# EAGLE schematic MP3_8xMulti_V1.0 (EAGLE 9.6.2)
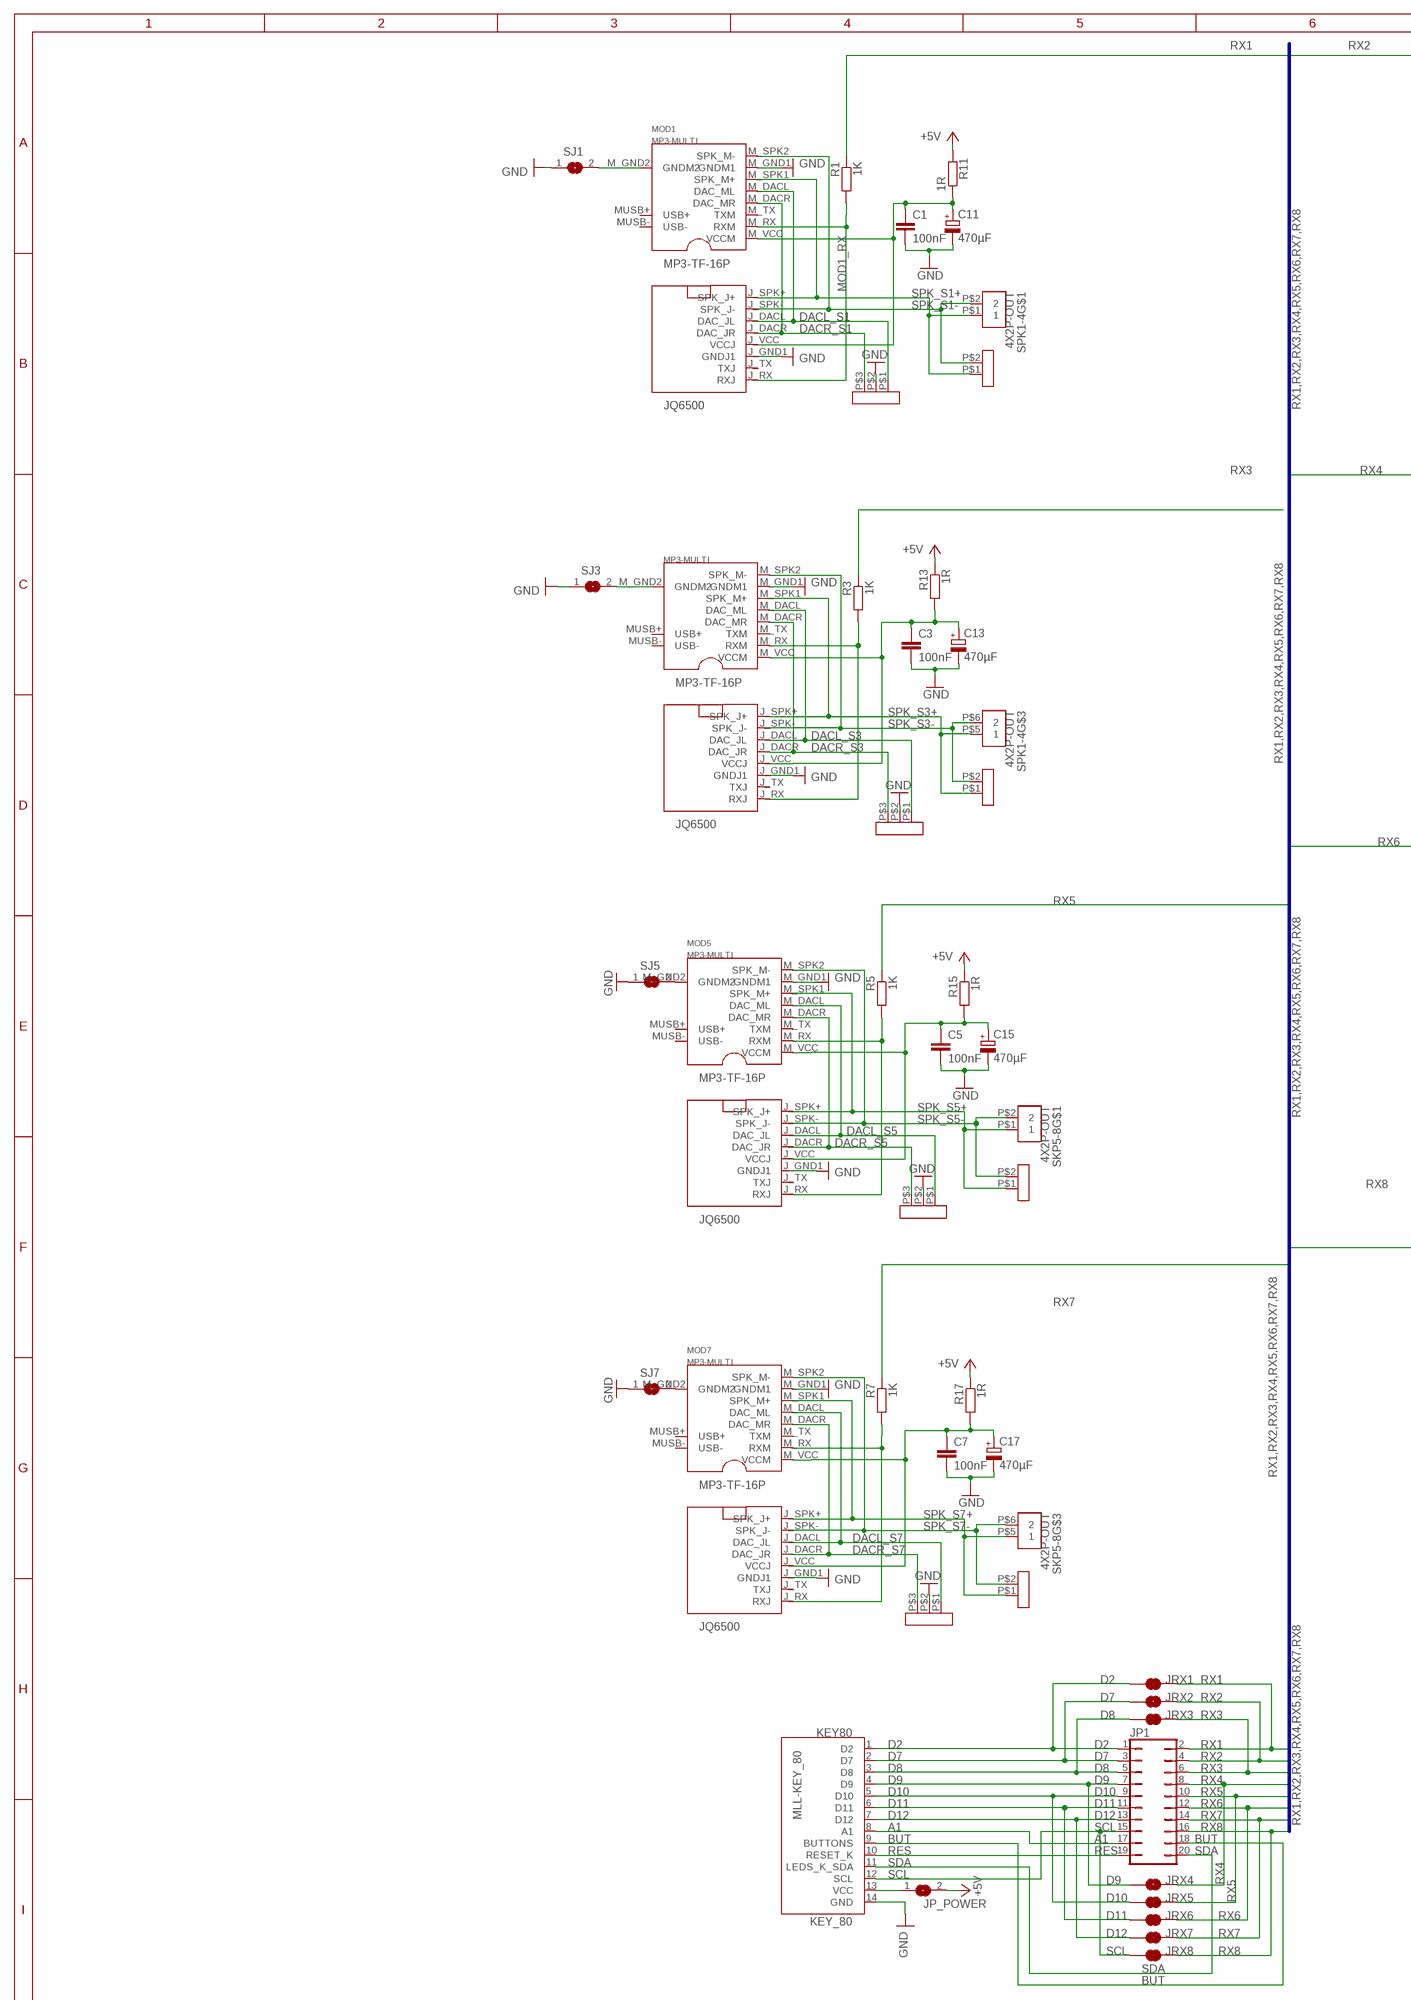
[diagram p0: schematic, sheet 1, part 1 of 2]
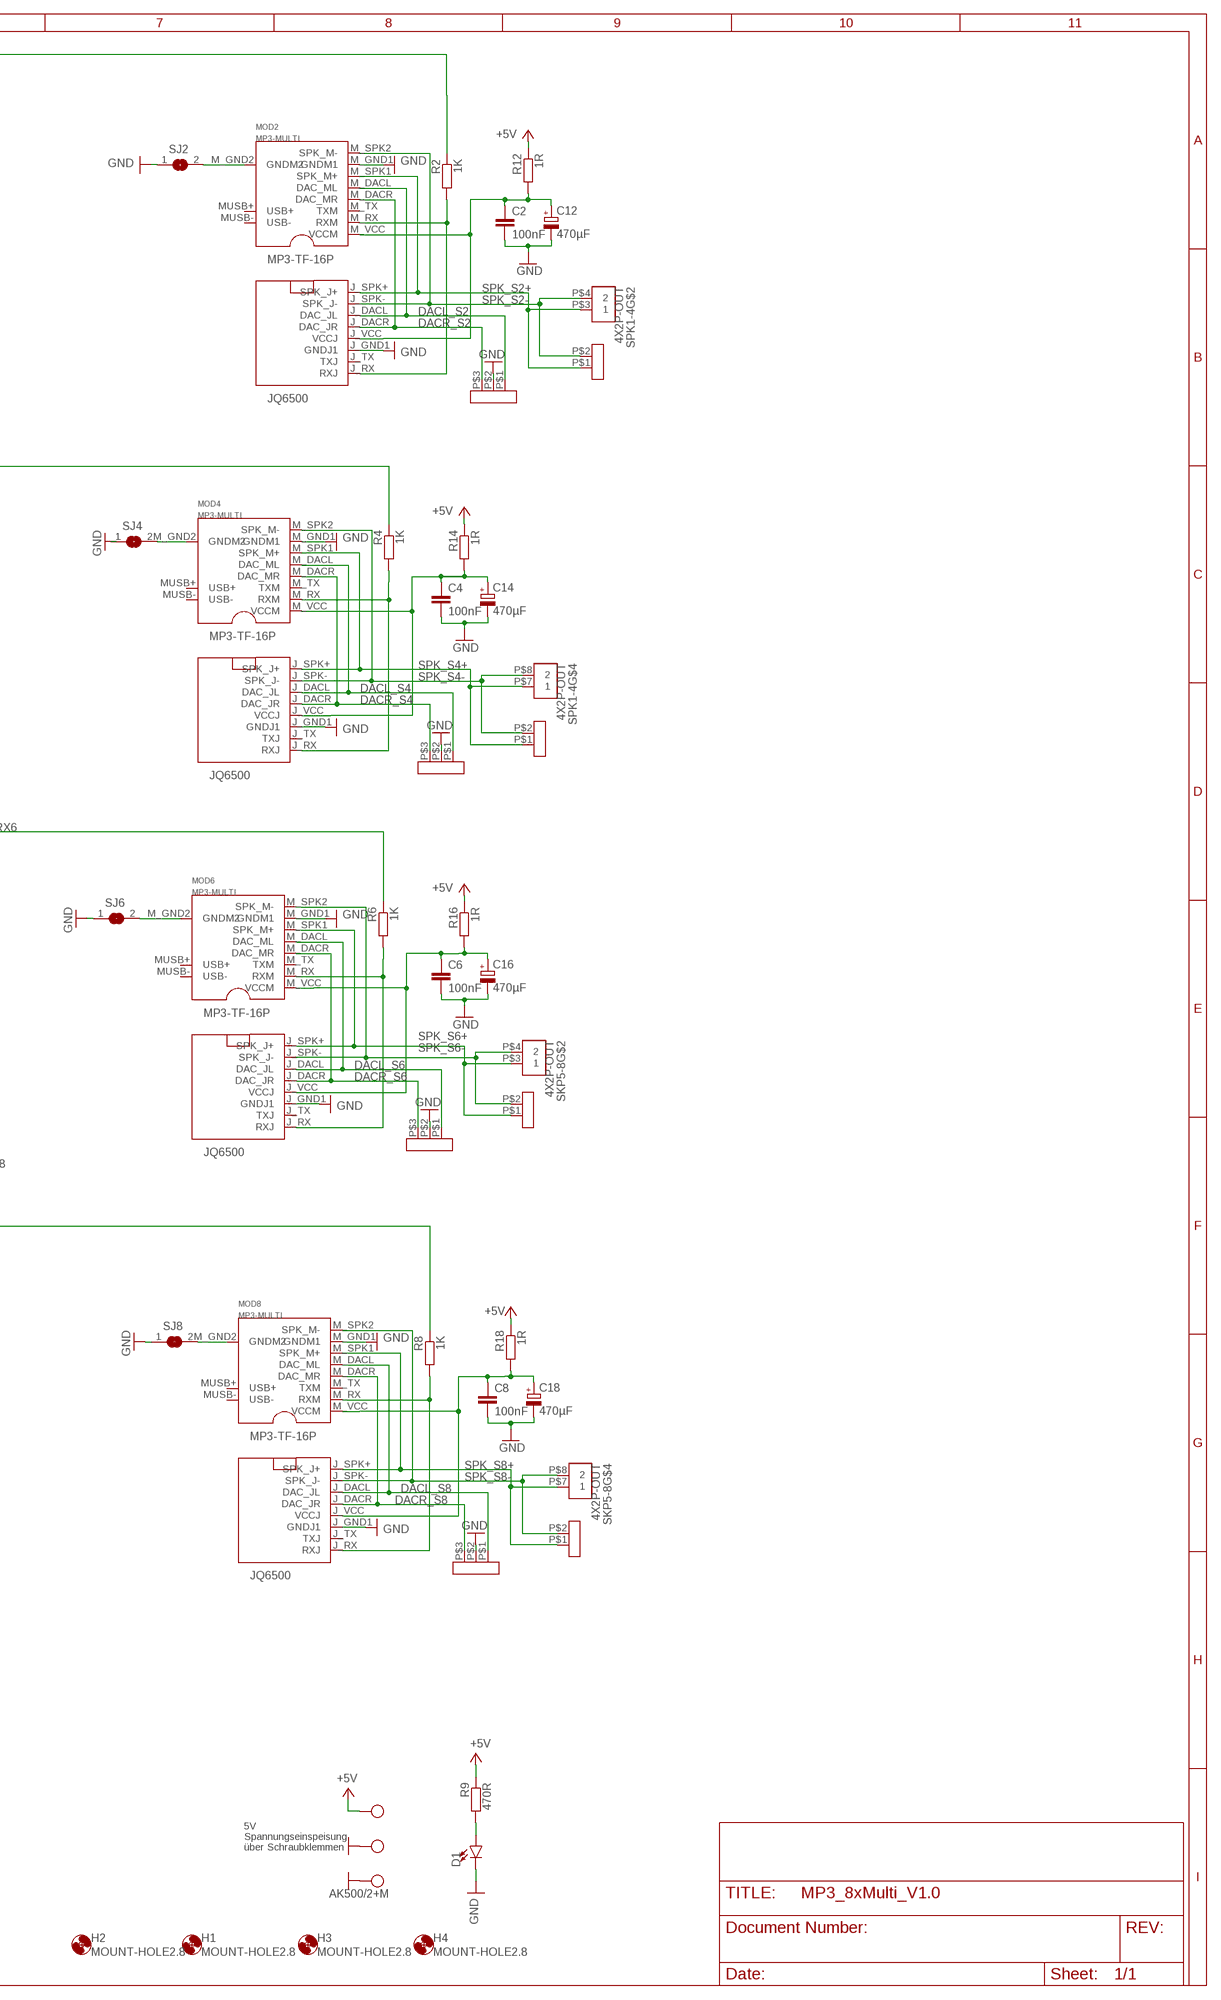
[diagram p1: schematic, sheet 1, part 2 of 2]

## Parts
C1  100nF  C-EU025-025X050  [C025-025X050]
C2  100nF  C-EU025-025X050  [C025-025X050]
C3  100nF  C-EU025-025X050  [C025-025X050]
C4  100nF  C-EU025-025X050  [C025-025X050]
C5  100nF  C-EU025-025X050  [C025-025X050]
C6  100nF  C-EU025-025X050  [C025-025X050]
C7  100nF  C-EU025-025X050  [C025-025X050]
C8  100nF  C-EU025-025X050  [C025-025X050]
C11  470µF  CPOL-EUE5-8.5  [E5-8,5]
C12  470µF  CPOL-EUE5-8.5  [E5-8,5]
C13  470µF  CPOL-EUE5-8.5  [E5-8,5]
C14  470µF  CPOL-EUE5-8.5  [E5-8,5]
C15  470µF  CPOL-EUE5-8.5  [E5-8,5]
C16  470µF  CPOL-EUE5-8.5  [E5-8,5]
C17  470µF  CPOL-EUE5-8.5  [E5-8,5]
C18  470µF  CPOL-EUE5-8.5  [E5-8,5]
D1  LED3MM  [LED_3MM]
DAC1  3XRM254  [3XRM254]
DAC2  3XRM254  [3XRM254]
DAC3  3XRM254  [3XRM254]
DAC4  3XRM254  [3XRM254]
DAC5  3XRM254  [3XRM254]
DAC6  3XRM254  [3XRM254]
DAC7  3XRM254  [3XRM254]
DAC8  3XRM254  [3XRM254]
H1  MOUNT-HOLE2.8  [2,8]
H2  MOUNT-HOLE2.8  [2,8]
H3  MOUNT-HOLE2.8  [2,8]
H4  MOUNT-HOLE2.8  [2,8]
JP1  JP10Q  [JP10Q]
JP_POWER  SJ  [SJ]
JRX1  JUMPER-SMT_2_NC_TRACE_NO-SILK  [SMT-JUMPER_2_NC_TRACE_NO-SILK]
JRX2  JUMPER-SMT_2_NC_TRACE_NO-SILK  [SMT-JUMPER_2_NC_TRACE_NO-SILK]
JRX3  JUMPER-SMT_2_NC_TRACE_NO-SILK  [SMT-JUMPER_2_NC_TRACE_NO-SILK]
JRX4  JUMPER-SMT_2_NC_TRACE_NO-SILK  [SMT-JUMPER_2_NC_TRACE_NO-SILK]
JRX5  JUMPER-SMT_2_NC_TRACE_NO-SILK  [SMT-JUMPER_2_NC_TRACE_NO-SILK]
JRX6  JUMPER-SMT_2_NC_TRACE_NO-SILK  [SMT-JUMPER_2_NC_TRACE_NO-SILK]
JRX7  JUMPER-SMT_2_NC_TRACE_NO-SILK  [SMT-JUMPER_2_NC_TRACE_NO-SILK]
JRX8  JUMPER-SMT_2_NC_TRACE_NO-SILK  [SMT-JUMPER_2_NC_TRACE_NO-SILK]
KEY80  KEY_80  [IDC14]
MOD1  MP3-MULTI  [MP3-TF16P_JQ6500]
MOD2  MP3-MULTI  [MP3-TF16P_JQ6500]
MOD3  MP3-MULTI  [MP3-TF16P_JQ6500]
MOD4  MP3-MULTI  [MP3-TF16P_JQ6500]
MOD5  MP3-MULTI  [MP3-TF16P_JQ6500]
MOD6  MP3-MULTI  [MP3-TF16P_JQ6500]
MOD7  MP3-MULTI  [MP3-TF16P_JQ6500]
MOD8  MP3-MULTI  [MP3-TF16P_JQ6500]
R1  1K  R-EU_0207/7  [0207/7]
R2  1K  R-EU_0207/7  [0207/7]
R3  1K  R-EU_0207/7  [0207/7]
R4  1K  R-EU_0207/7  [0207/7]
R5  1K  R-EU_0207/7  [0207/7]
R6  1K  R-EU_0207/7  [0207/7]
R7  1K  R-EU_0207/7  [0207/7]
R8  1K  R-EU_0207/7  [0207/7]
R9  470R  R-EU_0207/7  [0207/7]
R11  1R  R-EU_0207/7  [0207/7]
R12  1R  R-EU_0207/7  [0207/7]
R13  1R  R-EU_0207/7  [0207/7]
R14  1R  R-EU_0207/7  [0207/7]
R15  1R  R-EU_0207/7  [0207/7]
R16  1R  R-EU_0207/7  [0207/7]
R17  1R  R-EU_0207/7  [0207/7]
R18  1R  R-EU_0207/7  [0207/7]
SJ1  SJ  [SJ]
SJ2  SJ  [SJ]
SJ3  SJ  [SJ]
SJ4  SJ  [SJ]
SJ5  SJ  [SJ]
SJ6  SJ  [SJ]
SJ7  SJ  [SJ]
SJ8  SJ  [SJ]
SKP5-8  4X2P-OUT  [DG308]
SPK1  2XRM254  [2XRM254]
SPK1-4  4X2P-OUT  [DG308]
SPK2  2XRM254  [2XRM254]
SPK3  2XRM254  [2XRM254]
SPK4  2XRM254  [2XRM254]
SPK5  2XRM254  [2XRM254]
SPK6  2XRM254  [2XRM254]
SPK7  2XRM254  [2XRM254]
SPK8  2XRM254  [2XRM254]
X1  AK500/2+M  [AK500/2+M]

## Nets
+5V: JP_POWER.2 R9.1 R11.2 R12.1 R13.1 R14.1 R15.1 R16.1 R17.1 R18.1 X1.2
A1: JP1.17 KEY80.8(A1)
BUT: JP1.18 KEY80.9(BUTTONS)
D2: JP1.1 JRX1.1 KEY80.1(D2)
D7: JP1.3 JRX2.1 KEY80.2(D7)
D8: JP1.5 JRX3.1 KEY80.3(D8)
D9: JP1.7 JRX4.1 KEY80.4(D9)
D10: JP1.9 JRX5.1 KEY80.5(D10)
D11: JP1.11 JRX6.1 KEY80.6(D11)
D12: JP1.13 JRX7.1 KEY80.7(D12)
DACL_S1: DAC1.P$1 MOD1.J_DACL(DAC_JL) MOD1.M_DACL(DAC_ML)
DACL_S2: DAC2.P$1 MOD2.J_DACL(DAC_JL) MOD2.M_DACL(DAC_ML)
DACL_S3: DAC3.P$1 MOD3.J_DACL(DAC_JL) MOD3.M_DACL(DAC_ML)
DACL_S4: DAC4.P$1 MOD4.J_DACL(DAC_JL) MOD4.M_DACL(DAC_ML)
DACL_S5: DAC5.P$1 MOD5.J_DACL(DAC_JL) MOD5.M_DACL(DAC_ML)
DACL_S6: DAC6.P$1 MOD6.J_DACL(DAC_JL) MOD6.M_DACL(DAC_ML)
DACL_S7: DAC7.P$1 MOD7.J_DACL(DAC_JL) MOD7.M_DACL(DAC_ML)
DACL_S8: DAC8.P$1 MOD8.J_DACL(DAC_JL) MOD8.M_DACL(DAC_ML)
DACR_S1: DAC1.P$3 MOD1.J_DACR(DAC_JR) MOD1.M_DACR(DAC_MR)
DACR_S2: DAC2.P$3 MOD2.J_DACR(DAC_JR) MOD2.M_DACR(DAC_MR)
DACR_S3: DAC3.P$3 MOD3.J_DACR(DAC_JR) MOD3.M_DACR(DAC_MR)
DACR_S4: DAC4.P$3 MOD4.J_DACR(DAC_JR) MOD4.M_DACR(DAC_MR)
DACR_S5: DAC5.P$3 MOD5.J_DACR(DAC_JR) MOD5.M_DACR(DAC_MR)
DACR_S6: DAC6.P$3 MOD6.J_DACR(DAC_JR) MOD6.M_DACR(DAC_MR)
DACR_S7: DAC7.P$3 MOD7.J_DACR(DAC_JR) MOD7.M_DACR(DAC_MR)
DACR_S8: DAC8.P$3 MOD8.J_DACR(DAC_JR) MOD8.M_DACR(DAC_MR)
GND: C1.2 C2.2 C3.2 C4.2 C5.2 C6.2 C7.2 C8.2 C11.- C12.- C13.- C14.- C15.- C16.- C17.- C18.- D1.K(C) DAC1.P$2 DAC2.P$2 DAC3.P$2 DAC4.P$2 DAC5.P$2 DAC6.P$2 DAC7.P$2 DAC8.P$2 KEY80.14(GND) MOD1.J_GND1(GNDJ1) MOD1.M_GND1(GNDM1) MOD2.J_GND1(GNDJ1) MOD2.M_GND1(GNDM1) MOD3.J_GND1(GNDJ1) MOD3.M_GND1(GNDM1) MOD4.J_GND1(GNDJ1) MOD4.M_GND1(GNDM1) MOD5.J_GND1(GNDJ1) MOD5.M_GND1(GNDM1) MOD6.J_GND1(GNDJ1) MOD6.M_GND1(GNDM1) MOD7.J_GND1(GNDJ1) MOD7.M_GND1(GNDM1) MOD8.J_GND1(GNDJ1) MOD8.M_GND1(GNDM1) SJ1.1 SJ2.1 SJ3.1 SJ4.1 SJ5.1 SJ6.1 SJ7.1 SJ8.1 X1.1 X1.M
LED1: D1.A R9.2
M_GND1: MOD1.M_GND2(GNDM2) SJ1.2
M_GND2: MOD2.M_GND2(GNDM2) SJ2.2
M_GND3: MOD3.M_GND2(GNDM2) SJ3.2
M_GND4: MOD4.M_GND2(GNDM2) SJ4.2
M_GND5: MOD5.M_GND2(GNDM2) SJ5.2
M_GND6: MOD6.M_GND2(GNDM2) SJ6.2
M_GND7: MOD7.M_GND2(GNDM2) SJ7.2
M_GND8: MOD8.M_GND2(GNDM2) SJ8.2
MOD1_RX: MOD1.J_RX(RXJ) MOD1.M_RX(RXM) R1.2
MOD1_RX1: MOD2.J_RX(RXJ) MOD2.M_RX(RXM) R2.2
MOD1_RX2: MOD3.J_RX(RXJ) MOD3.M_RX(RXM) R3.2
MOD1_RX3: MOD4.J_RX(RXJ) MOD4.M_RX(RXM) R4.2
MOD1_RX4: MOD5.J_RX(RXJ) MOD5.M_RX(RXM) R5.2
MOD1_RX5: MOD6.J_RX(RXJ) MOD6.M_RX(RXM) R6.2
MOD1_RX6: MOD7.J_RX(RXJ) MOD7.M_RX(RXM) R7.2
MOD1_RX7: MOD8.J_RX(RXJ) MOD8.M_RX(RXM) R8.2
OPT-VCC: JP_POWER.1 KEY80.13(VCC)
RES: JP1.19 KEY80.10(RESET_K)
RX1: JP1.2 JRX1.2 R1.1
RX2: JP1.4 JRX2.2 R2.1
RX3: JP1.6 JRX3.2 R3.1
RX4: JP1.8 JRX4.2 R4.1
RX5: JP1.10 JRX5.2 R5.1
RX6: JP1.12 JRX6.2 R6.1
RX7: JP1.14 JRX7.2 R7.1
RX8: JP1.16 JRX8.2 R8.1
SCL: JP1.15 JRX8.1 KEY80.12(SCL)
SDA: JP1.20 KEY80.11(LEDS_K_SDA)
SOUND1_VCC: C1.1 C11.+ MOD1.J_VCC(VCCJ) MOD1.M_VCC(VCCM) R11.1
SOUND2_VCC: C2.1 C12.+ MOD2.J_VCC(VCCJ) MOD2.M_VCC(VCCM) R12.2
SOUND3_VCC: C3.1 C13.+ MOD3.J_VCC(VCCJ) MOD3.M_VCC(VCCM) R13.2
SOUND4_VCC: C4.1 C14.+ MOD4.J_VCC(VCCJ) MOD4.M_VCC(VCCM) R14.2
SOUND5_VCC: C5.1 C15.+ MOD5.J_VCC(VCCJ) MOD5.M_VCC(VCCM) R15.2
SOUND6_VCC: C6.1 C16.+ MOD6.J_VCC(VCCJ) MOD6.M_VCC(VCCM) R16.2
SOUND7_VCC: C7.1 C17.+ MOD7.J_VCC(VCCJ) MOD7.M_VCC(VCCM) R17.2
SOUND8_VCC: C8.1 C18.+ MOD8.J_VCC(VCCJ) MOD8.M_VCC(VCCM) R18.2
SPK_S1+: MOD1.J_SPK+(SPK_J+) MOD1.M_SPK1(SPK_M+) SPK1-4.P$1 SPK1.P$1
SPK_S1-: MOD1.J_SPK-(SPK_J-) MOD1.M_SPK2(SPK_M-) SPK1-4.P$2 SPK1.P$2
SPK_S2+: MOD2.J_SPK+(SPK_J+) MOD2.M_SPK1(SPK_M+) SPK1-4.P$3 SPK2.P$1
SPK_S2-: MOD2.J_SPK-(SPK_J-) MOD2.M_SPK2(SPK_M-) SPK1-4.P$4 SPK2.P$2
SPK_S3+: MOD3.J_SPK+(SPK_J+) MOD3.M_SPK1(SPK_M+) SPK1-4.P$5 SPK3.P$1
SPK_S3-: MOD3.J_SPK-(SPK_J-) MOD3.M_SPK2(SPK_M-) SPK1-4.P$6 SPK3.P$2
SPK_S4+: MOD4.J_SPK+(SPK_J+) MOD4.M_SPK1(SPK_M+) SPK1-4.P$7 SPK4.P$1
SPK_S4-: MOD4.J_SPK-(SPK_J-) MOD4.M_SPK2(SPK_M-) SPK1-4.P$8 SPK4.P$2
SPK_S5+: MOD5.J_SPK+(SPK_J+) MOD5.M_SPK1(SPK_M+) SKP5-8.P$1 SPK5.P$1
SPK_S5-: MOD5.J_SPK-(SPK_J-) MOD5.M_SPK2(SPK_M-) SKP5-8.P$2 SPK5.P$2
SPK_S6+: MOD6.J_SPK+(SPK_J+) MOD6.M_SPK1(SPK_M+) SKP5-8.P$3 SPK6.P$1
SPK_S6-: MOD6.J_SPK-(SPK_J-) MOD6.M_SPK2(SPK_M-) SKP5-8.P$4 SPK6.P$2
SPK_S7+: MOD7.J_SPK+(SPK_J+) MOD7.M_SPK1(SPK_M+) SKP5-8.P$5 SPK7.P$1
SPK_S7-: MOD7.J_SPK-(SPK_J-) MOD7.M_SPK2(SPK_M-) SKP5-8.P$6 SPK7.P$2
SPK_S8+: MOD8.J_SPK+(SPK_J+) MOD8.M_SPK1(SPK_M+) SKP5-8.P$7 SPK8.P$1
SPK_S8-: MOD8.J_SPK-(SPK_J-) MOD8.M_SPK2(SPK_M-) SKP5-8.P$8 SPK8.P$2
Unconnected: MOD1.J_TX(TXJ) MOD1.M_TX(TXM) MOD1.MUSB+(USB+) MOD1.MUSB-(USB-) MOD2.J_TX(TXJ) MOD2.M_TX(TXM) MOD2.MUSB+(USB+) MOD2.MUSB-(USB-) MOD3.J_TX(TXJ) MOD3.M_TX(TXM) MOD3.MUSB+(USB+) MOD3.MUSB-(USB-) MOD4.J_TX(TXJ) MOD4.M_TX(TXM) MOD4.MUSB+(USB+) MOD4.MUSB-(USB-) MOD5.J_TX(TXJ) MOD5.M_TX(TXM) MOD5.MUSB+(USB+) MOD5.MUSB-(USB-) MOD6.J_TX(TXJ) MOD6.M_TX(TXM) MOD6.MUSB+(USB+) MOD6.MUSB-(USB-) MOD7.J_TX(TXJ) MOD7.M_TX(TXM) MOD7.MUSB+(USB+) MOD7.MUSB-(USB-) MOD8.J_TX(TXJ) MOD8.M_TX(TXM) MOD8.MUSB+(USB+) MOD8.MUSB-(USB-)

## Buses
RX1,RX2,RX3,RX4,RX5,RX6,RX7,RX8

## Notes on the sheet
- 5V
  Spannungseinspeisung
  über Schraubklemmen

## Library data of the parts
C1-C8 = rcl:C-EU: CAPACITOR, European symbol; SPICEPREFIX: C
C11-C18 = rcl:CPOL-EU: POLARIZED CAPACITOR, European symbol; SPICEPREFIX: C
D1 = SparkFun-LED:LED: LED (Generic) Standard schematic elements and footprints for 5mm, 3mm, 1206, and 0603 sized LEDs. Generic LEDs with no color specified.; PROD_ID: DIO-08794
DAC1-DAC8 = MLL-Dominik-Hardi:3XRM254
H1-H4 = holes:MOUNT-HOLE: MOUNTING HOLE with drill center marker
JP1 = jumper:JP10Q: JUMPER
JP_POWER SJ1-SJ8 = jumper:SJ: SMD solder JUMPER
JRX1-JRX8 = SparkFun-Jumpers:JUMPER-SMT_2_NC_TRACE: Normally closed trace jumper This jumper has a trace between two pads so it's normally closed (NC). Use a razor knife to open the connection. For best results follow the IPC guidelines for cutting traces: Cutout at least 0.063 mm (0.005 in). Remove all loose material to clean up the cut area. Seal the cut with an approved epoxy. Reapply solder to reclose the connection.
KEY80 = MLL-Dominik-Hardi:KEY_80
MOD1-MOD8 = MLL-Dominik-Hardi:MP3-MULTI
R1-R9 R11-R18 = rcl:R-EU_: RESISTOR, European symbol; SPICEPREFIX: R
SKP5-8 SPK1-4 = MLL-Dominik-Hardi:4X2P-OUT
SPK1-SPK8 = MLL-Dominik-Hardi:2XRM254
X1 = Arduino_fuer_LEDs_DCC_2:AK500/2+M